# EAGLE schematic MagicRadio2 (EAGLE 6.5.0)
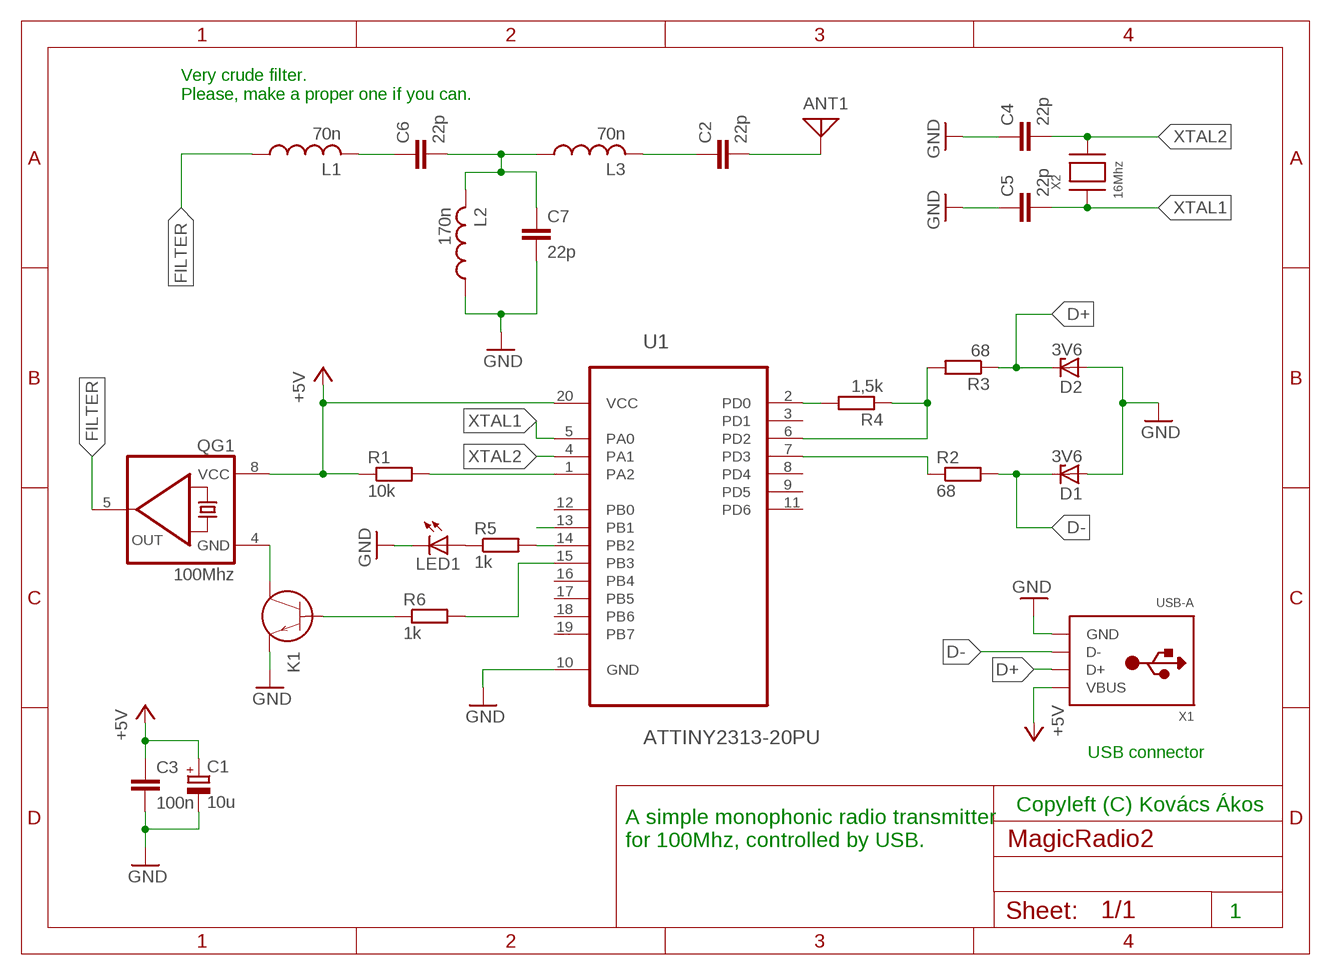
[diagram p0: schematic, sheet 1]

## Parts
ANT1  ANTENNA  [PAD-01]
C1  10u  CPOL-EUE2.5-6  [E2,5-6]
C2  22p  C-EU025-024X044  [C025-024X044]
C3  100n  C-EU025-024X044  [C025-024X044]
C4  22p  C-EU025-024X044  [C025-024X044]
C5  22p  C-EU025-024X044  [C025-024X044]
C6  22p  C-EU025-024X044  [C025-024X044]
C7  22p  C-EU025-024X044  [C025-024X044]
D1  3V6  ZENER-DIODEDO34-7  [DO34Z7]
D2  3V6  ZENER-DIODEDO34-7  [DO34Z7]
K1  NPN-TRANSISTOR  [NPN-TRANSISTOR]
L1  70n  L-USTFI0307  [TFI0307]
L2  170n  L-USTFI0307  [TFI0307]
L3  70n  L-USTFI0307  [TFI0307]
LED1  LED  [SMARTLED-TTW]
QG1  100Mhz  QG5460  [DIL08S]
R1  10k  R-EU_0204/5  [0204/5]
R2  68  R-EU_0204/5  [0204/5]
R3  68  R-EU_0204/5  [0204/5]
R4  1,5k  R-EU_0204/5  [0204/5]
R5  1k  R-EU_0204/5  [0204/5]
R6  1k  R-EU_0204/5  [0204/5]
U1  ATTINY2313-20PU  [DIP254P762X533-20]
X1  USB-A  [MOLEX_480371000]
X2  16Mhz  XTAL-3.2X1.5  [XTAL3215]

## Nets
+5V: C1.+ C3.1 QG1.8(VCC) R1.1 U1.20(VCC) X1.1(VBUS)
D+: D2.C R3.1 X1.3(D+)
D-: D1.C R2.2 X1.2(D-)
FILTER: L1.1 QG1.5(OUT)
GND: C1.- C3.2 C4.1 C5.1 C7.2 D1.A D2.A K1.E L2.1 LED1.C@1(C) U1.10(GND) X1.4(GND)
N$1: K1.C QG1.4(GND)
N$2: R3.2 R4.1 U1.6(PD2)
N$3: R5.2 U1.14(PB2)
N$4: R2.1 U1.7(PD3)
N$5: K1.B R6.1
N$6: LED1.A@1(A) R5.1
N$7: R6.2 U1.15(PB3)
N$10: U1.13(PB1)
N$11: C6.2 C7.1 L2.2 L3.1
N$12: C2.1 L3.2
N$13: ANT1.1 C2.2
N$14: C6.1 L1.2
RST: R1.2 U1.1(PA2)
RX: R4.2 U1.2(PD0)
XTAL1: C5.2 U1.5(PA0) X2.P$1
XTAL2: C4.2 U1.4(PA1) X2.P$2
Unconnected: U1.3(PD1) U1.8(PD4) U1.9(PD5) U1.11(PD6) U1.12(PB0) U1.16(PB4) U1.17(PB5) U1.18(PB6) U1.19(PB7)

## Notes on the sheet
- Very crude filter. 
  Please, make a proper one if you can.
- USB connector
- Copyleft (C) Kovács Ákos
- A simple monophonic radio transmitter
  for 100Mhz, controlled by USB.
- 1

## Library data of the parts
ANT1 = discrete:ANTENNA: Antenna
C1 = rcl:CPOL-EU: POLARIZED CAPACITOR, European symbol
C2-C7 = rcl:C-EU: CAPACITOR, European symbol
D1 D2 = diode:ZENER-DIODE: Z-Diode
K1 = e-halbleiter:NPN-TRANSISTOR: NPN-Transistor
L1-L3 = rcl:L-US: INDUCTOR, American symbol
LED1 = led:LED: LED OSRAM: - CHIPLED LG R971, LG N971, LY N971, LG Q971, LY Q971, LO R971, LY R971 LH N974, LH R974 LS Q976, LO Q976, LY Q976 LO Q996 - Hyper CHIPLED LW Q18S LB Q993, LB Q99A, LB R99A - SideLED LS A670, LO A670, LY A670, LG A670, LP A670 LB A673, LV A673, LT A673, LW A673 LH A674 LY A675 LS A676, LA A676, LO A676, LY A676, LW A676 LS A679, LY A679, LG A679 - Hyper Micro SIDELED® LS Y876, LA Y876, LO Y876, LY Y876 LT Y87S - SmartLED LW L88C, LW L88S LB L89C, LB L89S, LG L890 LS L89K, LO L89K, LY L89K LS L896, LA L896, LO L896, LY L896 - TOPLED LS T670, LO T670, LY T670, LG T670, LP T670 LSG T670, LSP T670, LSY T670, LOP T670, LYG T670 LG T671, LOG T671, LSG T671 LB T673, LV T673, LT T673, LW T673 LH T674 LS T676, LA T676, LO T676, LY T676, LB T676, LH T676, LSB T676, LW T676 LB T67C, LV T67C, LT T67C, LS T67K, LO T67K, LY T67K, LW E67C LS E67B, LA E67B, LO E67B, LY E67B, LB E67C, LV E67C, LT E67C LW T67C LS T679, LY T679, LG T679 LS T770, LO T770, LY T770, LG T770, LP T770 LB T773, LV T773, LT T773, LW T773 LH T774 LS E675, LA E675, LY E675, LS T675 LS T776, LA T776, LO T776, LY T776, LB T776 LHGB T686 LT T68C, LB T68C - Hyper Mini TOPLED® LB M676 - Mini TOPLED Santana® LG M470 LS M47K, LO M47K, LY M47K Source: http://www.osram.convergy.de LUXEON: - LUMILED® LXK2-PW12-R00, LXK2-PW12-S00, LXK2-PW14-U00, LXK2-PW14-V00 LXK2-PM12-R00, LXK2-PM12-S00, LXK2-PM14-U00 LXK2-PE12-Q00, LXK2-PE12-R00, LXK2-PE12-S00, LXK2-PE14-T00, LXK2-PE14-U00 LXK2-PB12-K00, LXK2-PB12-L00, LXK2-PB12-M00, LXK2-PB14-N00, LXK2-PB14-P00, LXK2-PB14-Q00 LXK2-PR12-L00, LXK2-PR12-M00, LXK2-PR14-Q00, LXK2-PR14-R00 LXK2-PD12-Q00, LXK2-PD12-R00, LXK2-PD12-S00 LXK2-PH12-R00, LXK2-PH12-S00 LXK2-PL12-P00, LXK2-PL12-Q00, LXK2-PL12-R00 Source: www.luxeon.com KINGBRIGHT: KA-3528ASYC Source: www.kingbright.com
QG1 = crystal:QG5460: CRYSTAL RESONATOR; OC_FARNELL: unknown; OC_NEWARK: unknown
R1-R6 = rcl:R-EU_: RESISTOR, European symbol
U1 = Atmel_By_element14_Batch_1-00:ATTINY2313-20PU: Microcontroller; MPN: ATTINY2313-20PU; OC_FARNELL: 9171592; OC_NEWARK: 96K6525; PACKAGE: DIP-20; SUPPLIER: ATMEL
X1 = adafruit:USB-A: USB type A 'plug' Used for things that can directly connect to a USB port, say USB key
X2 = adafruit:XTAL: Low cost SMT crystals, no capacitors included http://www.ladyada.net/library/eagle